# Altium project M26_M_V1.0.PrjPCB
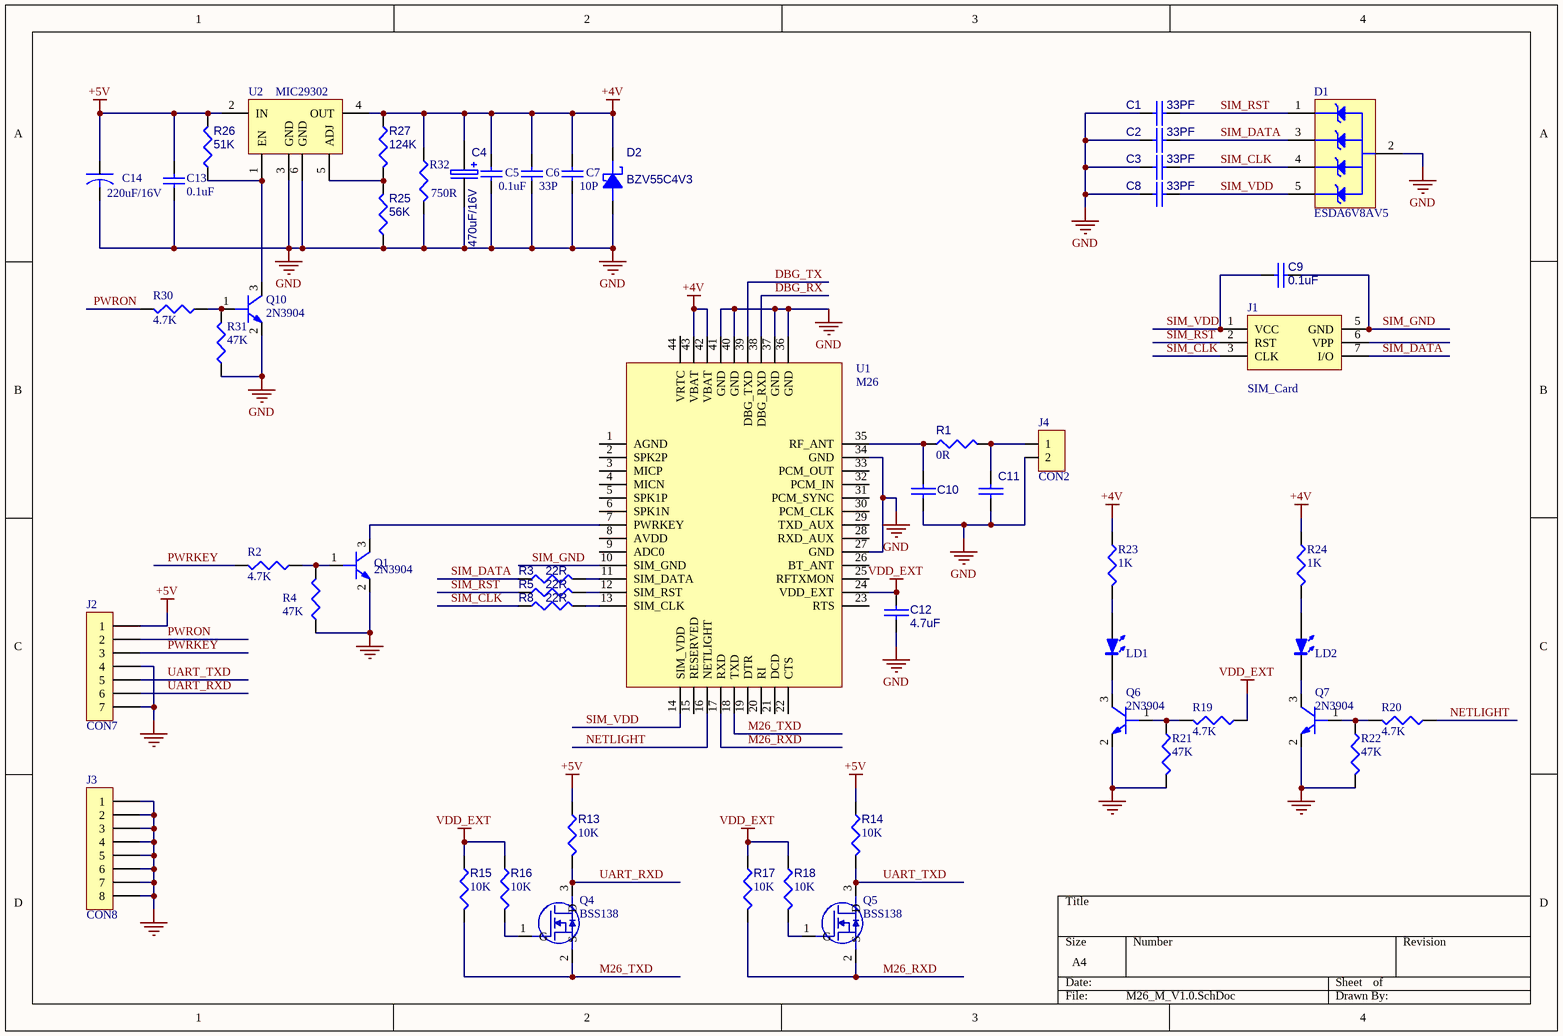
[diagram p0: M26_M_V1.0.SchDoc]
1 sheet, 54 parts. Net scope: global (net labels, ports and power ports of the same name join across sheets).
Board file: M26_M_V1.0.2.PcbDoc

## Sheet M26_M_V1.0.SchDoc
size A4

### Parts
C1  33PF  [0603_C]
C2  33PF  [0603_C]
C3  33PF  [0603_C]
C4  470uF/16V  [C_TAN_D]
C5  0.1uF  [0603_C]
C6  33P  [0603_C]
C7  10P  [0603_C]
C8  33PF  [0603_C]
C9  0.1uF  [0603_C]
C10  NC  [0603_C]  (value not drawn)
C11  NC  [0603_C]  (value not drawn)
C12  4.7uF  [0603_C]
C13  0.1uF  [0603_C]
C14  220uF/16V  [C_TAN_D]
D1  ESDA6V8AV5  [SOT-553]
D2  BZV55C4V3  [SOD-80]
J1  SIM_Card  [MicroSIM-6]
J2  CON7  [SIP7]
J3  CON8  [SIP-8]
J4  CON2  [RF-Z]
LD1  WHITE  [LED_0603]  (value not drawn)
LD2  WHITE  [LED_0603]  (value not drawn)
Q1  2N3904  [SOT23]
Q4  BSS138  [SOT23]
Q5  BSS138  [SOT23]
Q6  2N3904  [SOT23]
Q7  2N3904  [SOT23]
Q10  2N3904  [SOT23]
R1  0R  [0603_R]
R2  4.7K  [0603_R]
R3  22R  [0603_R]
R4  47K  [0603_R]
R5  22R  [0603_R]
R8  22R  [0603_R]
R13  10K  [0603_R]
R14  10K  [0603_R]
R15  10K  [0603_R]
R16  10K  [0603_R]
R17  10K  [0603_R]
R18  10K  [0603_R]
R19  4.7K  [0603_R]
R20  4.7K  [0603_R]
R21  47K  [0603_R]
R22  47K  [0603_R]
R23  1K  [0603_R]
R24  1K  [0603_R]
R25  56K  [0603_R]
R26  51K  [0603_R]
R27  124K  [0603_R]
R30  4.7K  [0603_R]
R31  47K  [0603_R]
R32  750R  [0603_R]
U1  M26  [M26]
U2  MIC29302  [TO-263-5]

### Nets
+4V: C4.1(+) C5.2 C6.2 C7.2 D2.2(CATHODE) R23.1 R24.1 R27.2 R32.2 U1.42(VBAT) U1.43(VBAT) U2.4(OUT)
+5V: C13.2 C14.1 J2.1 R13.1 R14.1 R26.1 U2.2(IN)
GND: C1.1 C2.1 C3.1 C4.2(-) C5.1 C6.1 C7.1 C8.1 C10.2 C11.2 C12.2 C13.1 C14.2 D1.2 D2.1(ANODE) J2.4 J2.7 J3.1 J3.2 J3.3 J3.4 J3.5 J3.6 J3.7 J3.8 J4.2 Q1.2(EMITTER) Q6.2(EMITTER) Q7.2(EMITTER) Q10.2(EMITTER) R4.2 R21.2 R22.2 R25.2 R31.2 R32.1 U1.27(GND) U1.34(GND) U1.36(GND) U1.37(GND) U1.40(GND) U1.41(GND) U2.3(GND) U2.6(GND)
VDD_EXT: C12.1 R15.1 R16.1 R17.1 R18.1 R19.1 U1.24(VDD_EXT)
DBG_RX: U1.38(DBG_RXD)
DBG_TX: U1.39(DBG_TXD)
M26_RXD: Q5.2(S) R17.2 U1.17(RXD)
M26_TXD: Q4.2(S) R15.2 U1.18(TXD)
NETLIGHT: R20.1 U1.16(NETLIGHT)
PWRKEY: J2.3 R2.1
PWRON: J2.2 R30.1
SIM_CLK: C3.2 D1.4 J1.3(CLK) R8.1
SIM_DATA: C2.2 D1.3 J1.7(I/O) R3.1
SIM_GND: C9.2 J1.5(GND) U1.10(SIM_GND)
SIM_RST: C1.2 D1.1 J1.2(RST) R5.1
SIM_VDD: C8.2 C9.1 D1.5 J1.1(VCC) U1.14(SIM_VDD)
UART_RXD: J2.6 Q4.3(D) R13.2
UART_TXD: J2.5 Q5.3(D) R14.2
NetC10_1: C10.1 R1.1 U1.35(RF_ANT)
NetC11_1: C11.1 J4.1 R1.2
NetLD1_A: LD1.A R23.2
NetLD1_K: LD1.K Q6.3(COLLECTOR)
NetLD2_A: LD2.A R24.2
NetLD2_K: LD2.K Q7.3(COLLECTOR)
NetQ1_1: Q1.1(BASE) R2.2 R4.1
NetQ1_3: Q1.3(COLLECTOR) U1.7(PWRKEY)
NetQ4_1: Q4.1(G) R16.2
NetQ5_1: Q5.1(G) R18.2
NetQ6_1: Q6.1(BASE) R19.2 R21.1
NetQ7_1: Q7.1(BASE) R20.2 R22.1
NetQ10_1: Q10.1(BASE) R30.2 R31.1
NetQ10_3: Q10.3(COLLECTOR) R26.2 U2.1(EN)
NetR3_2: R3.2 U1.11(SIM_DATA)
NetR5_2: R5.2 U1.12(SIM_RST)
NetR8_2: R8.2 U1.13(SIM_CLK)
NetR25_1: R25.1 R27.1 U2.5(ADJ)

Not connected (* = marked no-connect by the designer): J1 6(VPP); U1 1(AGND) 2(SPK2P) 3(MICP) 4(MICN) 5(SPK1P) 6(SPK1N) 8(AVDD) 9(ADC0) 15(RESERVED) 19(DTR) 20(RI) 21(DCD) 22(CTS) 23(RTS) 25(RFTXMON) 26(BT_ANT) 28(RXD_AUX) 29(TXD_AUX) 30(PCM_CLK) 31(PCM_SYNC) 32(PCM_IN) 33(PCM_OUT) 44(VRTC)

### Library data of the parts
C1-C3 C8-C12 = CAP
C4 = ECAP: E-CAP
C5-C7 C13 = Cap Semi: Capacitor; Published: 8-Jun-2000; LatestRevisionDate: 29-May-2009; LatestRevisionNote: IPC-7351 Footprint Added.; PackageReference: C1206; Publisher: Altium Limited; PackageDescription: Chip Capacitor
C14 = C
D2 = DIODE SCHOTTKY
LD1 LD2 = LED
Q1 Q6 Q7 Q10 = NPN
Q4 Q5 = N-Channel Enhancement MOSFET
R1 R13-R18 = Res3_3: Resistor; Published: 8-Jun-2000; LatestRevisionDate: 29-May-2009; LatestRevisionNote: IPC-7351 Footprint Added.; PackageReference: J1-0603; Publisher: Altium Limited; PackageDescription: Chip Resistor
R2 R4 R19-R24 R30-R32 = RES1
R3 R5 R8 R25-R27 = R0.25W: RESISTOR